# EAGLE design latoLV (EAGLE 9.3.1)
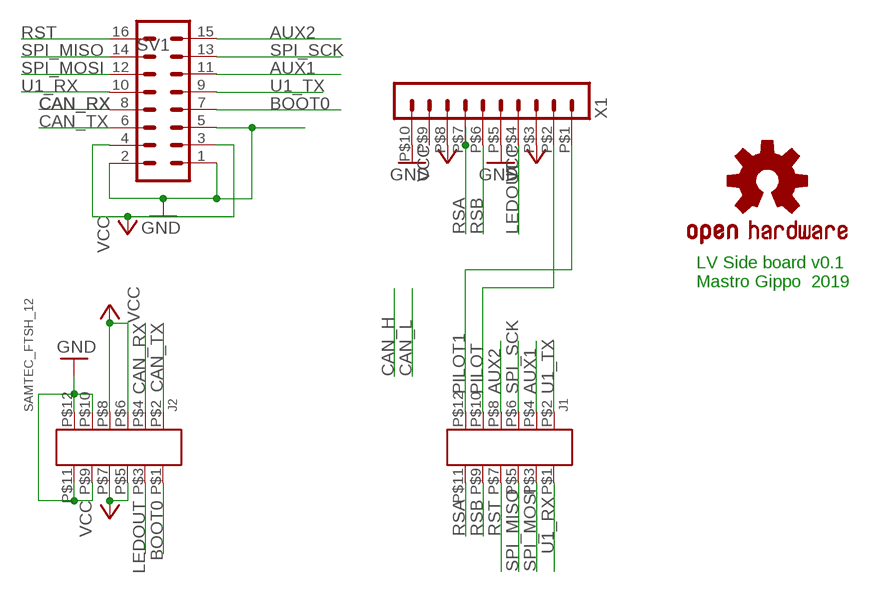
[diagram p0: schematic, sheet 1]

## Parts
J1  SAMTEC_FTSH_12  [6X2_1MM]
J2  SAMTEC_FTSH_12  [6X2_1MM]
SV1  MA08-2  [MA08-2]
U$1  OSHW-LOGOS  [OSHW-LOGO-S]
X1  HEADER_POS10_43045-1012  [43045-1012]

## Nets
AUX1: J1.P$4 SV1.11
AUX2: J1.P$8 SV1.15
BOOT0: J2.P$1 SV1.7
CAN_RX: J2.P$4 SV1.8
CAN_TX: J2.P$2 SV1.6
GND: J2.P$9 J2.P$10 J2.P$11 J2.P$12 SV1.1 SV1.2 SV1.5 X1.P$5 X1.P$10
LEDOUT: J2.P$3 X1.P$4
PILOT: J1.P$10 X1.P$2
PILOT1: J1.P$12 X1.P$1
RSA: J1.P$11 X1.P$7
RSB: J1.P$9 X1.P$6
RST: J1.P$7 SV1.16
SPI_MISO: J1.P$5 SV1.14
SPI_MOSI: J1.P$3 SV1.12
SPI_SCK: J1.P$6 SV1.13
U1_RX: J1.P$1 SV1.10
U1_TX: J1.P$2 SV1.9
VCC: J2.P$5 J2.P$6 J2.P$7 J2.P$8 SV1.3 SV1.4 X1.P$3 X1.P$8
Unconnected: X1.P$9

## Notes on the sheet
- LV Side board v0.1
  Mastro Gippo  2019

## Library data of the parts
J1 J2 = mastrogippo:SAMTEC_FTSH_12
SV1 = con-lstb:MA08-2: PIN HEADER; OC_FARNELL: unknown; OC_NEWARK: unknown
U$1 = mastrogippo:OSHW-LOGO: Open Source Hardware Logo This logo indicates the piece of hardware it is found on incorporates a OSHW license and/or adheres to the definition of open source hardware found here: http://freedomdefined.org/OSHW
X1 = con-molex-micro-fit-3_0:HEADER_POS10_?: Molex - Micro-Fit 3.0 Series connector, 3.00mm (0.118") pitch header, 10 positions.

## Board
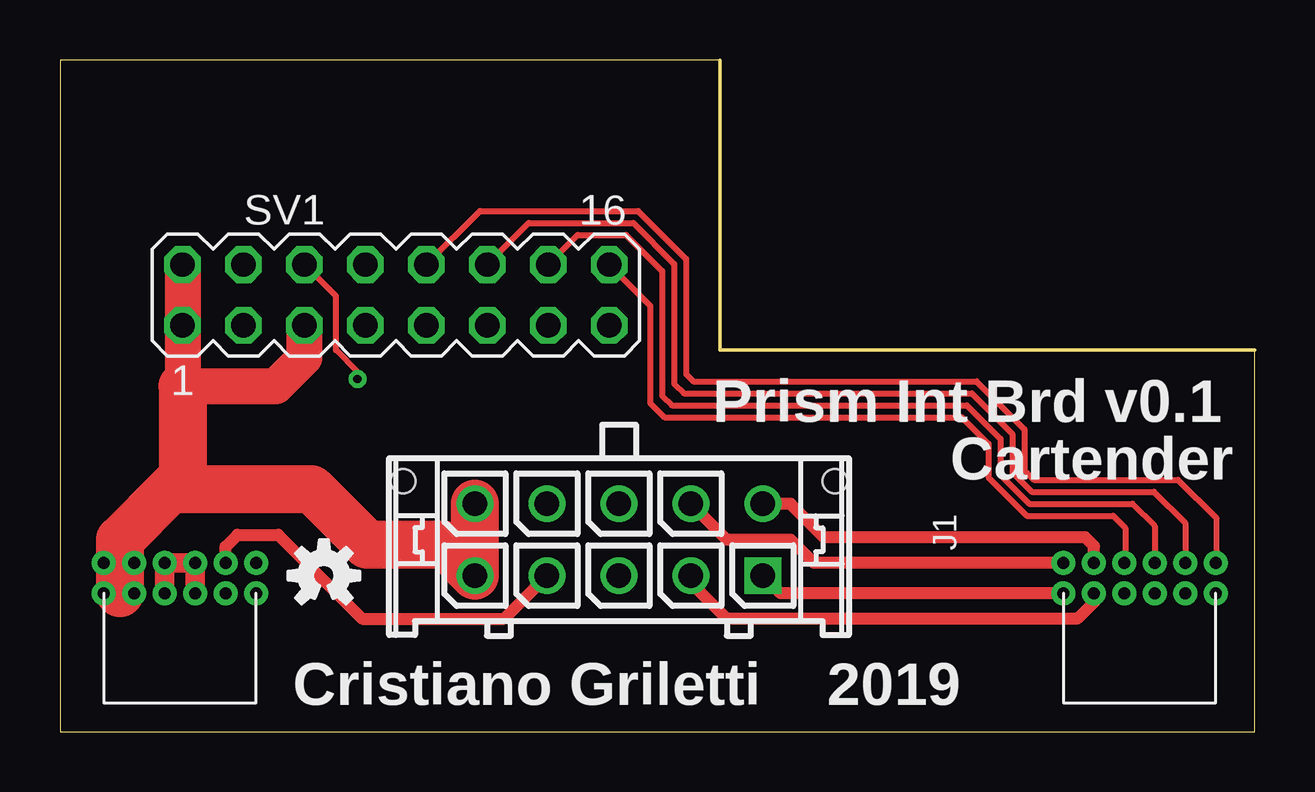
[diagram p1: board, top side]
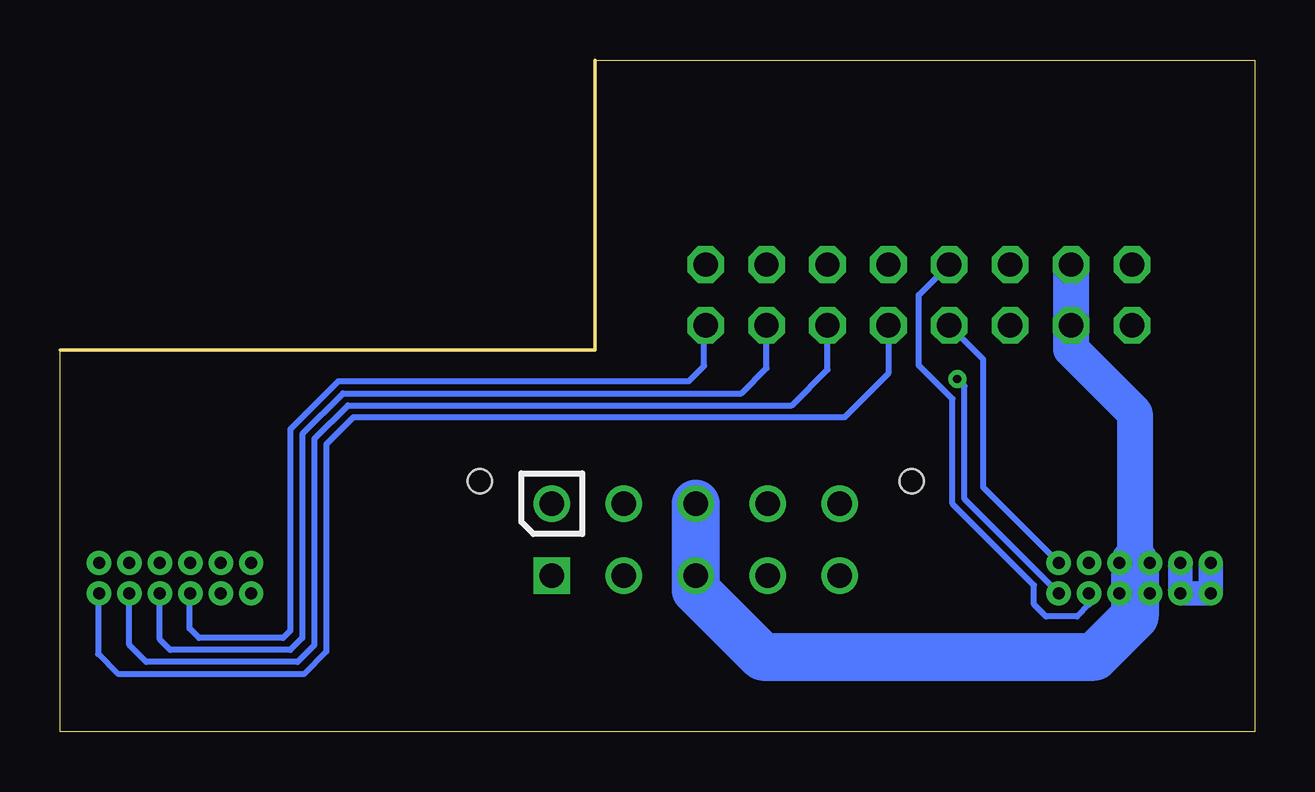
[diagram p2: board, bottom side, seen from below]

Size 49.8 x 28 mm. Coordinates in mm from the lower left corner, seen from the top.
Outline: 0,0 49.8,0 49.8,15.9 27.5,15.9 27.5,28 0,28 0,0
Copper layers (1*16): Top 0.035mm / dielectric 1.5mm / Bottom 0.035mm
Design rules "default": minimum track width 6mil, minimum drill 0.35mm, track to track 6mil, track to pad 6mil, pad to pad 6mil, via to via 6mil, smd to smd 6mil, copper to edge 40mil, drill to drill 6mil, minimum pad ring 10mil, minimum via ring 8mil, stop-mask expansion 4mil, vias tented up to drill 0mil, thermal gap 10mil

### Footprints (pad centres in the part's own frame; a part is rotated, then mirrored left to right if it is on the bottom)
6X2_1MM = drill 0.5 pad 0.8: P$1 -0.635,3.175; P$2 0.635,3.175; P$3 -0.635,1.905; P$4 0.635,1.905; P$5 -0.635,0.635; P$6 0.635,0.635; P$7 -0.635,-0.635; P$8 0.635,-0.635; P$9 -0.635,-1.905; P$10 0.635,-1.905; P$11 -0.635,-3.175; P$12 0.635,-3.175
MA08-2 = drill 1.016 octagon: 1 -8.89,-1.27; 2 -8.89,1.27; 3 -6.35,-1.27; 4 -6.35,1.27; 5 -3.81,-1.27; 6 -3.81,1.27; 7 -1.27,-1.27; 8 -1.27,1.27; 9 1.27,-1.27; 10 1.27,1.27; 11 3.81,-1.27; 12 3.81,1.27; 13 6.35,-1.27; 14 6.35,1.27; 15 8.89,-1.27; 16 8.89,1.27
43045-1012 = drill 1.02 square: P$1 6,0 | drill 1.02: P$2 3,0; P$3 0,0; P$4 -3,0; P$5 -6,0; P$6 6,3; P$7 3,3; P$8 0,3; P$9 -3,3; P$10 -6,3 | hole 1.02: 9,3.94; -9,3.94

### Placement (x,y rotation side)
J1  45,6.4 270 top
J2  5,6.4 270 top
SV1  14,18.2 0 top
U$1  11,6.5 0 top
X1  23.3,6.5 0 top

### Tracks (layer width: path | path; a pad name or v marks a point on that pad's centre or on a via)
AUX1
  Bottom 0.254: J1.P$4 46.91,3.6 46.2,2.9 39.9,2.9 39.2,3.6 39.2,12.2 37.8,13.6 19.3,13.6 17.81,15.09 SV1.11
AUX2
  Bottom 0.254: J1.P$8 44.4,5.73 44.4,4.3 44,3.9 40.5,3.9 40.2,4.2 40.2,12.6 38.2,14.6 23.6,14.6 22.95,15.25 22.95,16.87 SV1.15
BOOT0
  Bottom 0.254: SV1.7 11.33,15.53 11.33,10.19 J2.P$1
CAN_RX
  Bottom 0.254: J2.P$4 6.91,5.29 7.4,4.8 8.7,4.8 9.2,5.3 9.2,6.1 12.6,9.5 12.6,13.87 14,15.27 14,18.2 SV1.8
CAN_TX  (via drill 0.35)
  Top 0.254: v12.4,14.7 12.4,15 11.5,15.9 11.5,18.16 SV1.6
  Bottom 0.254: J2.P$2 12.1,9.69 12.1,14.4 v12.4,14.7
GND
  Top 1.016: J2.P$12 2.5,5.76 J2.P$10
  Top 1.5: SV1.2 SV1.1 5.11,14.4 9,14.4 10.19,15.59 SV1.5
  Top 2: 4.61,10.11 2.5,8 2.5,5.76 | 4.61,10.11 10.49,10.11 12.8,7.8 16,7.8 X1.P$5 X1.P$10 | 5.11,14.4 5.11,10.61 4.61,10.11
  Bottom 1.016: J2.P$9 J2.P$10 J2.P$12 J2.P$11
LEDOUT
  Top 0.508: J2.P$3 6.9,7.7 7.4,8.2 9.1,8.2 12.6,4.7 18.5,4.7 X1.P$4
PILOT
  Top 0.508: J1.P$10 43.09,5.39 42.4,4.7 27.8,4.7 26.3,6.2 X1.P$2
PILOT1
  Top 0.508: X1.P$1 30.04,5.76 J1.P$12
RSA
  Top 0.508: J1.P$11 31.43,7.04 30.46,8 27.8,8 X1.P$7
RSB
  Top 0.508: J1.P$9 43.09,7.74 42.73,8.1 31.85,8.1 30.45,9.5 X1.P$6
RST
  Top 0.254: J1.P$7 44.4,7.07 44.4,8.5 43.9,9 40.3,9 38.7,10.6 38.7,12 37.6,13.1 25.2,13.1 24.6,13.7 24.6,17.76 SV1.16
SPI_MISO
  Top 0.254: SV1.14 21.58,20.7 23.6,20.7 25.1,19.2 25.1,14 25.5,13.6 37.8,13.6 39.2,12.2 39.2,10.7 40.4,9.5 44.7,9.5 45.63,8.56 J1.P$5
SPI_MOSI
  Top 0.254: SV1.12 19.54,21.2 23.9,21.2 25.6,19.5 25.6,14.5 26,14.1 38,14.1 39.7,12.4 39.7,10.8 40.5,10 45.6,10 46.9,8.7 J1.P$3
SPI_SCK
  Bottom 0.254: J1.P$6 45.63,3.83 45.2,3.4 40.2,3.4 39.7,3.9 39.7,12.4 38,14.1 21.4,14.1 20.35,15.15 SV1.13
U1_RX
  Top 0.254: SV1.10 17.5,21.7 24.1,21.7 26.1,19.7 26.1,14.9 26.4,14.6 38.2,14.6 40.2,12.6 40.2,10.9 40.6,10.5 46.6,10.5 48.2,8.9 48.2,7.06 J1.P$1
U1_TX
  Bottom 0.254: SV1.9 15.27,14.93 17.1,13.1 37.58,13.1 38.7,11.98 38.7,3.33 39.63,2.39 47.37,2.39 48.21,3.24 48.21,5.73 J1.P$2
VCC
  Top 0.813: J2.P$8 J2.P$7 J2.P$5 J2.P$6
  Bottom 1.016: J2.P$7 5,7.04 J2.P$5
  Bottom 1.5: 5,7.04 5,13.28 7.65,15.93 SV1.3 SV1.4
  Bottom 2: 5,7.04 5,4.8 6.68,3.12 20.52,3.12 23.3,5.9 X1.P$3 X1.P$8

### Text on the board
tNames: Prism Int Brd v0.1 | Cartender | Cristiano Griletti 2019